# EAGLE design Pedals Inline Test Board rev1 (EAGLE 8.3.2)
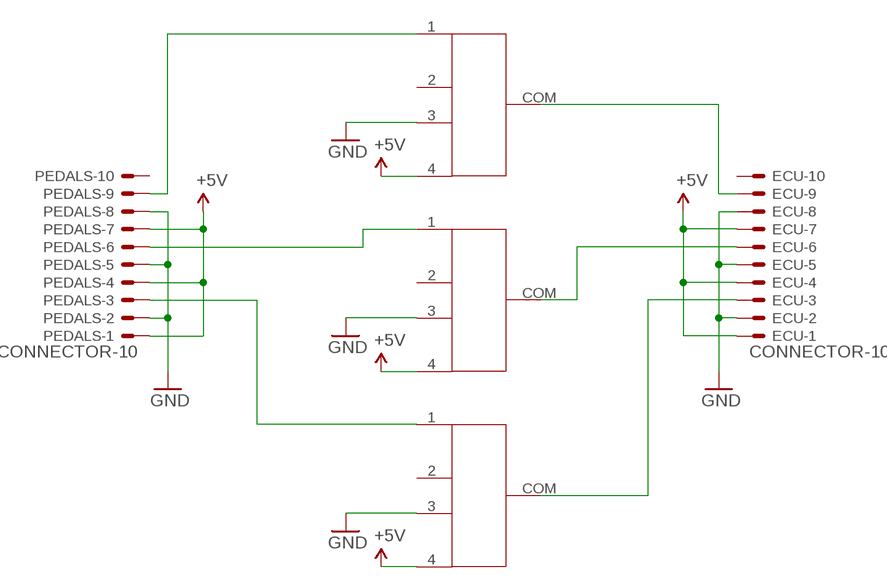
[diagram p0: schematic, sheet 1]

## Parts
ECU  CONNECTOR-10  [MINIFIT_5566-10]
PEDALS  CONNECTOR-10  [MINIFIT_5566-10]
U$1  SS-14D0839-VG5PA  [SS-14D0839-VG5PA]
U$2  SS-14D0839-VG5PA  [SS-14D0839-VG5PA]
U$3  SS-14D0839-VG5PA  [SS-14D0839-VG5PA]

## Nets
+5V: ECU.1 ECU.4 ECU.7 PEDALS.1 PEDALS.4 PEDALS.7 U$1.4 U$2.4 U$3.4
GND: ECU.2 ECU.5 ECU.8 PEDALS.2 PEDALS.5 PEDALS.8 U$1.3 U$2.3 U$3.3
N$1: ECU.9 U$1.COM
N$2: ECU.6 U$2.COM
N$3: ECU.3 U$3.COM
N$4: PEDALS.9 U$1.1
N$5: PEDALS.6 U$2.1
N$6: PEDALS.3 U$3.1
Unconnected: ECU.10 PEDALS.10 U$1.2 U$2.2 U$3.2

## Library data of the parts
ECU PEDALS = HyTechDevices:CONNECTOR-10: Mini-Fit Junior connector 10 pole Source: http://www.molex.com; OC_FARNELL: unknown; OC_NEWARK: unknown
U$1-U$3 = HyTechDevices:SS-14D0839-VG5PA

## Board
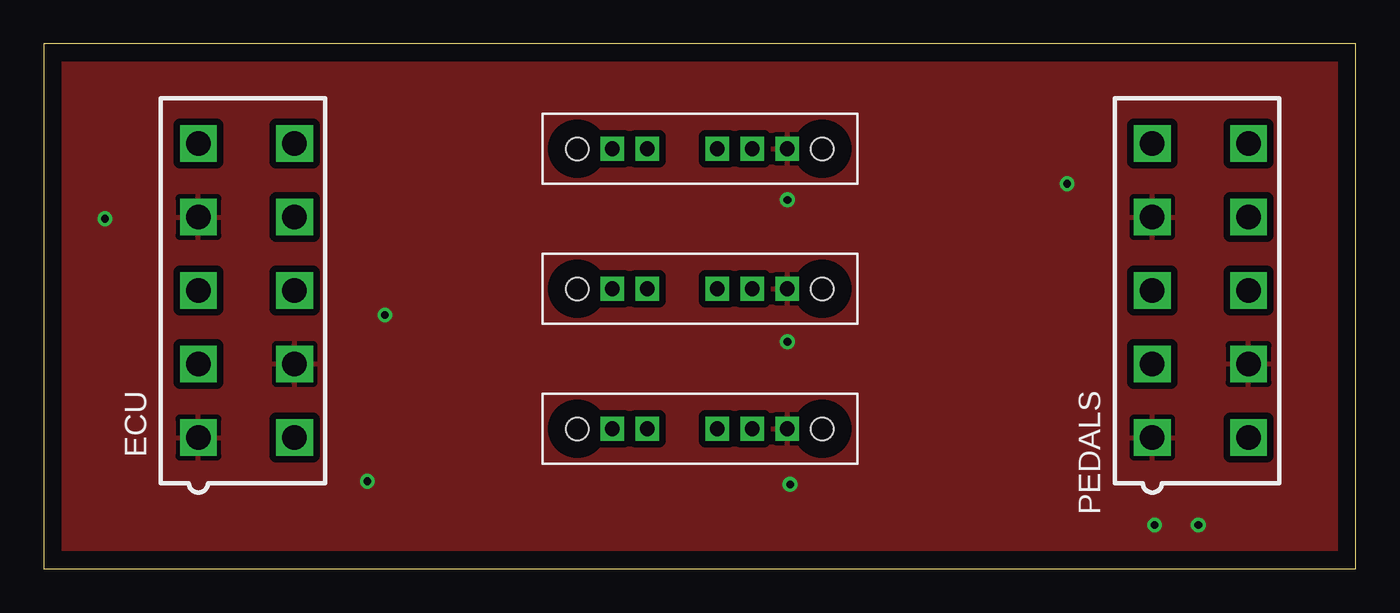
[diagram p1: board, top side]
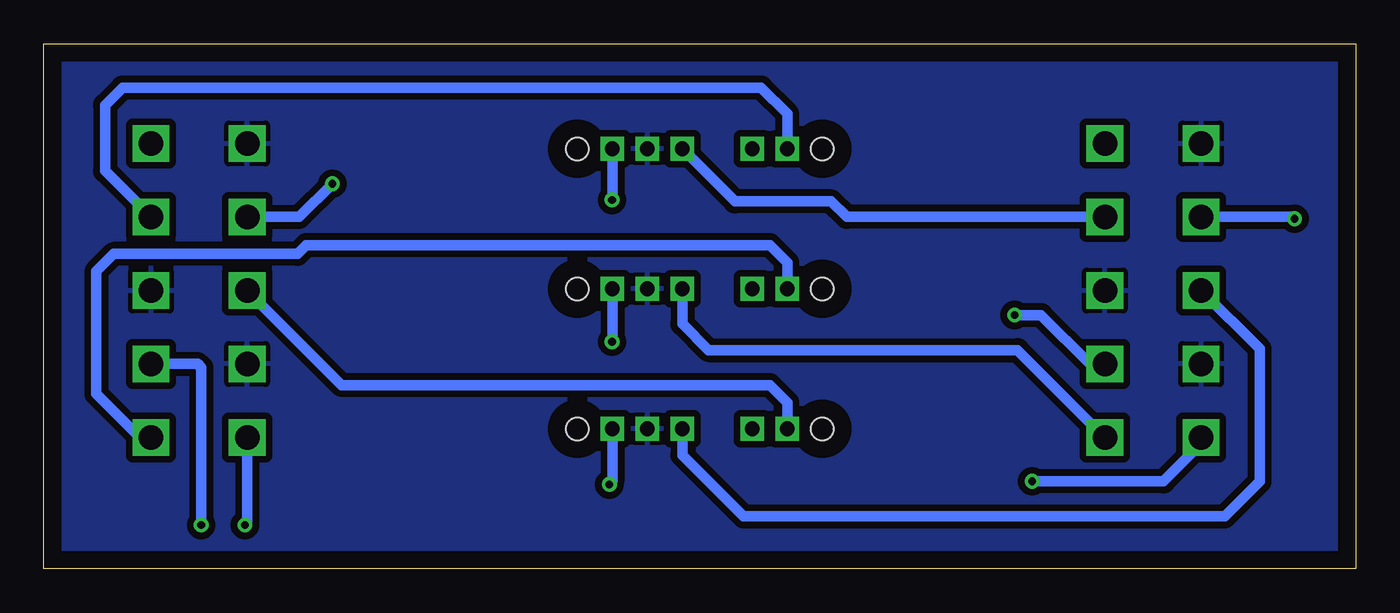
[diagram p2: board, bottom side, seen from below]

Size 75 x 30 mm. Coordinates in mm from the lower left corner, seen from the top.
Outline: 0,0 75,0 75,30 0,30 0,0
Copper layers (1*16): Top 0.035mm / dielectric 1.5mm / Bottom 0.035mm
Design rules "default *": minimum track width 6mil, minimum drill 0.35mm, track to track 15mil, track to pad 15mil, pad to pad 15mil, via to via 15mil, smd to smd 15mil, copper to edge 40mil, drill to drill 6mil, minimum pad ring 10mil, minimum via ring 8mil, stop-mask expansion 4mil, vias tented up to drill 0mil, thermal gap 10mil

### Footprints (pad centres in the part's own frame; a part is rotated, then mirrored left to right if it is on the bottom)
MINIFIT_5566-10 = drill 1.4 square: 1 8.4,-2.75; 2 4.2,-2.75; 3 0,-2.75; 4 -4.2,-2.75; 5 -8.4,-2.75; 6 8.4,2.75; 7 4.2,2.75; 8 0,2.75; 9 -4.2,2.75; 10 -8.4,2.75
SS-14D0839-VG5PA = drill 0.85 square: 1 -16,6; 2 -14,6; 3 -8,6; 4 -6,6; COM -10,6 | hole 1.3: -18,6; -4,6

### Placement (x,y rotation side)
ECU  11.59,15.9 270 top
PEDALS  66.12,15.9 270 top
U$1  48.5,18 0 top
U$2  48.5,10 0 top
U$3  48.5,2 0 top

### Tracks (layer width: path | path; a pad name or v marks a point on that pad's centre or on a via)
+5V  (via drill 0.45)
  Bottom 0.61: ECU.7 15.2,11.7 18,14.5 v19.5,14.5 | ECU.4 3.6,20.1 v3.5,20 | ECU.1 8.84,7.16 11,5 v18.5,5 | PEDALS.4 60.4,20.1 v58.5,22 | PEDALS.1 63.37,2.63 v63.5,2.5 | PEDALS.7 66.2,11.7 66,11.5 v66,2.5 | U$1.4 42.5,21.09 v42.52,21.07 | U$2.4 42.5,12.99 v42.52,12.97 | U$3.4 42.5,4.99 v42.67,4.82
  pour Top: 0,30 0,0 75,0 75,30
GND
  pour Bottom: 0,30 75,30 75,0 0,0
N$1
  Bottom 0.61: ECU.9 29.1,20.1 30,21 35.5,21 U$1.COM
N$2
  Bottom 0.61: U$2.COM 38.5,14 37,12.5 19.34,12.5 ECU.6
N$3
  Bottom 0.61: U$3.COM 38.5,6.5 35,3 7.5,3 5.5,5 5.5,12.56 ECU.3
N$4
  Bottom 0.61: PEDALS.9 71.5,22.73 71.5,26.5 70.5,27.5 34,27.5 32.5,26 U$1.1
N$5
  Bottom 0.61: U$2.1 32.5,17.5 33.5,18.5 60,18.5 60.5,18 71,18 72,17 72,10 69,7 69,7.37 PEDALS.6
N$6
  Bottom 0.61: U$3.1 32.5,9.5 33.5,10.5 57.97,10.5 PEDALS.3

### Text on the board
tDocu: ACCEL1 | C:/Users/S. Kim/circuits-2017/Board Designs/Bitmaps for logos/HyTech_square.bmp | ACCEL2 | BRAKE | NORMAL | OPEN | GND | +5V